# Altium schematic sheet GSM_Link_12_MCU.SchDoc
size A
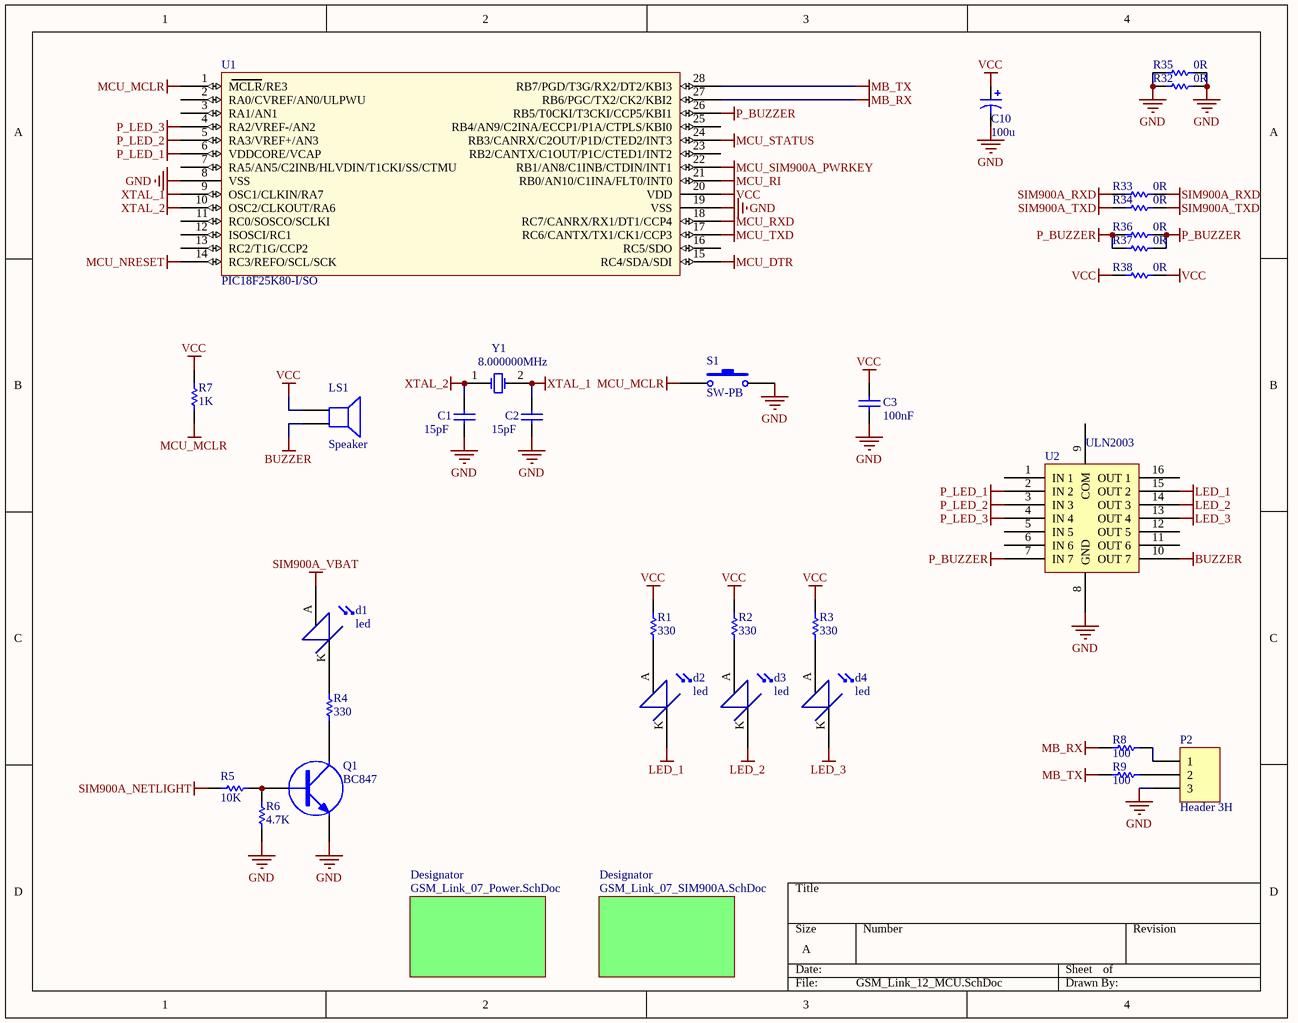
[diagram p0: GSM_Link_12_MCU.SchDoc]

## Parts
C1  15pF  [0805_smd]
C2  15pF  [0805_smd]
C3  100nF  [0805_smd]
C10  100u  [RB.1/.2_P]
d1  led  [0603_LED_SMD]
d2  led  [0603_LED_SMD]
d3  led  [0603_LED_SMD]
d4  led  [0603_LED_SMD]
LS1  Speaker  [BZ_KD]
P2  Header 3H  [CON3_XH]
Q1  BC847  [SOT23_SMD]
R1  330  [0805_SMD]
R2  330  [0805_SMD]
R3  330  [0805_SMD]
R4  330  [0805_SMD]
R5  10K  [0805_SMD]
R6  4.7K  [0805_SMD]
R7  1K  [1206_SMD]
R8  100  [0805_SMD]
R9  100  [0805_SMD]
R32  0R  [1206_SMD]
R33  0R  [1206_SMD]
R34  0R  [1206_SMD]
R35  0R  [1206_SMD]
R36  0R  [1206_SMD]
R37  0R  [2010_SMD]
R38  0R  [1206_SMD]
S1  SW-PB  [switch3_smd]
U1  PIC18F25K80-I/SO  [SOIC28_SMD]
U2  ULN2003  [SO-16_smd]
Y1  8.000000MHz  [rad-0.2]

## Sub-sheets
Designator = GSM_Link_07_SIM900A.SchDoc: no entries
Designator = GSM_Link_07_Power.SchDoc: no entries

## Nets
BUZZER: LS1.2 U2.10(OUT_7)
GND: C1.1 C2.1 C3.1 C10.2 P2.3 Q1.2(E) R6.1 R32.1 R32.2 R35.1 R35.2 S1.2 U1.8(VSS) U1.19(VSS) U2.8(GND)
LED_1: d2.K U2.15(OUT_2)
LED_2: d3.K U2.14(OUT_3)
LED_3: d4.K U2.13(OUT_4)
MB_RX: R8.1 U1.27(RB6/PGC/TX2/CK2/KBI2)
MB_TX: R9.1 U1.28(RB7/PGD/T3G/RX2/DT2/KBI3)
MCU_DTR: U1.15(RC4/SDA/SDI)
MCU_MCLR: R7.2 S1.1 U1.1(MCLR/RE3)
MCU_NRESET: U1.14(RC3/REFO/SCL/SCK)
MCU_RI: U1.21(RB0/AN10/C1INA/FLT0/INT0)
MCU_RXD: U1.18(RC7/CANRX/RX1/DT1/CCP4)
MCU_SIM900A_PWRKEY: U1.22(RB1/AN8/C1INB/CTDIN/INT1)
MCU_STATUS: U1.24(RB3/CANRX/C2OUT/P1D/CTED2/INT3)
MCU_TXD: U1.17(RC6/CANTX/TX1/CK1/CCP3)
P_BUZZER: R36.1 R36.2 R37.1 R37.2 U1.26(RB5/T0CKI/T3CKI/CCP5/KBI1) U2.7(IN_7)
P_LED_1: U1.6(VDDCORE/VCAP) U2.2(IN_2)
P_LED_2: U1.5(RA3/VREF+/AN3) U2.3(IN_3)
P_LED_3: U1.4(RA2/VREF-/AN2) U2.4(IN_4)
SIM900A_NETLIGHT: R5.2
SIM900A_RXD: R33.1 R33.2
SIM900A_TXD: R34.1 R34.2
SIM900A_VBAT: d1.A
VCC: C3.2 C10.1 LS1.1 R1.1 R2.1 R3.1 R7.1 R38.1 R38.2 U1.20(VDD)
XTAL_1: C2.2 U1.9(OSC1/CLKIN/RA7) Y1.2(OSC2)
XTAL_2: C1.2 U1.10(OSC2/CLKOUT/RA6) Y1.1(OSC1)
Netd1_K: d1.K R4.1
Netd2_A: d2.A R1.2
Netd3_A: d3.A R2.2
Netd4_A: d4.A R3.2
NetP2_1: P2.1 R8.2
NetP2_2: P2.2 R9.2
NetQ1_1: Q1.1(B) R5.1 R6.2
NetQ1_3: Q1.3(C) R4.2

Not connected (* = marked no-connect by the designer): U1 2(RA0/CVREF/AN0/ULPWU) 3(RA1/AN1) 7(RA5/AN5/C2INB/HLVDIN/T1CKI/SS/CTMU) 11(RC0/SOSCO/SCLKI) 12(ISOSCI/RC1) 13(RC2/T1G/CCP2) 16(RC5/SDO) 23(RB2/CANTX/C1OUT/P1C/CTED1/INT2) 25(RB4/AN9/C2INA/ECCP1/P1A/CTPLS/KBI0); U2 1(IN_1) 5(IN_5) 6(IN_6) 9(COM) 11(OUT_6) 12(OUT_5) 16(OUT_1)

## Library data of the parts
C1-C3 = Cap: Capacitor; Value: 100pF; Published: 8-Jun-2000; LatestRevisionDate: 17-Jul-2002; LatestRevisionNote: Re-released for DXP Platform.; PackageReference: RAD-0.3; Publisher: Altium Limited
C10 = Cap Pol1: Polarized Capacitor (Radial); Value: 100nF; Published: 8-Jun-2000; LatestRevisionDate: 17-Jul-2002; LatestRevisionNote: Re-released for DXP Platform.; PackageReference: RB7.6-15; Publisher: Altium Limited
LS1 = Speaker: Loudspeaker; Published: 24-Mar-1999; LatestRevisionDate: 17-Jul-2002; LatestRevisionNote: Re-released for DXP Platform.; PackageReference: PIN2; Publisher: Altium Limited
P2 = Header 3H: Header, 3-Pin, Right Angle; LatestRevisionDate: 17-Jul-2002; LatestRevisionNote: Re-released for DXP Platform.; Publisher: Altium Limited
Q1 = BC547
R1-R9 = Res1: Resistor; Published: 8-Jun-2000; LatestRevisionDate: 17-Jul-2002; LatestRevisionNote: Re-released for DXP Platform.; PackageReference: AXIAL-0.3; Publisher: Altium Limited
  R1-R4: Value: 330
  R5: Value: 10k
  R6: Value: 4.7k
  R7: Value: 1K
  R8 R9: Value: 100
R32-R38 = Res1: Resistor; Value: 0; Published: 8-Jun-2000; LatestRevisionDate: 17-Jul-2002; LatestRevisionNote: Re-released for DXP Platform.; PackageReference: AXIAL-0.3; Publisher: Altium Limited
S1 = SW-PB: Switch; Published: 24-Mar-1999; LatestRevisionDate: 17-Jul-2002; LatestRevisionNote: Re-released for DXP Platform.; PackageReference: SPST-2; Publisher: Altium Limited
Y1 = XTAL: Crystal Oscillator; Published: 8-Jun-2000; LatestRevisionDate: 17-Jul-2002; LatestRevisionNote: Re-released for DXP Platform.; PackageReference: R38; Publisher: Altium Limited